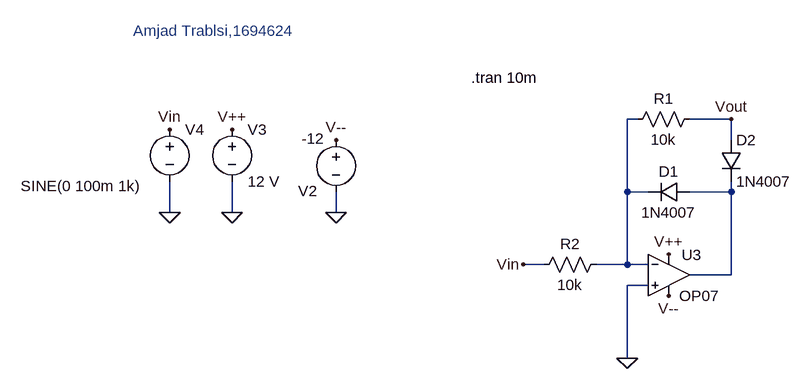
[diagram p0: schematic 1_1 Diode.asc]
1_1 Diode.asc, the LTspice schematic file:
Version 4
SHEET 1 880 680
WIRE 224 -64 208 -64
WIRE 368 -64 304 -64
WIRE 368 -32 368 -64
WIRE 208 48 208 -64
WIRE 240 48 208 48
WIRE 368 48 368 32
WIRE 368 48 304 48
WIRE -496 80 -496 32
WIRE -400 80 -400 32
WIRE -240 80 -240 48
WIRE 80 160 48 160
WIRE 208 160 208 48
WIRE 208 160 160 160
WIRE 240 160 208 160
WIRE 368 176 368 48
WIRE 368 176 304 176
WIRE 240 192 208 192
WIRE 208 304 208 192
FLAG 208 304 0
FLAG -400 80 0
FLAG -496 80 0
FLAG -400 -48 V++
FLAG 272 208 V--
FLAG 272 144 V++
FLAG -496 -48 Vin
FLAG 48 160 Vin
FLAG 368 -64 Vout
FLAG -240 80 0
FLAG -240 -32 V--
SYMBOL res 320 -80 R90
WINDOW 0 0 56 VBottom 2
WINDOW 3 32 56 VTop 2
SYMATTR InstName R1
SYMATTR Value 10k
SYMBOL diode 304 32 R90
WINDOW 0 0 32 VBottom 2
WINDOW 3 32 32 VTop 2
SYMATTR InstName D1
SYMATTR Value 1N4007
SYMBOL diode 352 -32 R0
SYMATTR InstName D2
SYMATTR Value 1N4007
SYMBOL res 176 144 R90
WINDOW 0 0 56 VBottom 2
WINDOW 3 32 56 VTop 2
SYMATTR InstName R2
SYMATTR Value 10k
SYMBOL voltage -240 -48 R0
WINDOW 0 -58 95 Left 2
WINDOW 3 -53 14 Left 2
WINDOW 123 0 0 Left 0
WINDOW 39 0 0 Left 0
SYMATTR InstName V2
SYMATTR Value -12
SYMBOL voltage -400 -64 R0
WINDOW 123 0 0 Left 0
WINDOW 39 0 0 Left 0
SYMATTR InstName V3
SYMATTR Value 12 V
SYMBOL voltage -496 -64 R0
WINDOW 3 -229 103 Left 2
WINDOW 123 0 0 Left 0
WINDOW 39 0 0 Left 0
SYMATTR InstName V4
SYMATTR Value SINE(0 100m 1k)
SYMBOL OpAmps\\OP07 272 112 R0
WINDOW 0 20 33 Left 2
SYMATTR InstName U3
TEXT -32 -128 Left 2 !.tran 10m
TEXT -552 -200 Left 2 ;Amjad Trablsi,1694624

The netlist it stands for:
* 1_1 Diode.asc
R1 Vout N001 10k
D1 N002 N001 1N4007
D2 Vout N002 1N4007
R2 N001 Vin 10k
V2 V-- 0 -12
V3 V++ 0 12 V
V4 Vin 0 SINE(0 100m 1k)
XU3 0 N001 V++ V-- N002 LT1001  ; OP07, pins In+ In- V+ V- OUT
.model D D
.lib standard.dio
.tran 10m
* Amjad Trablsi,1694624
.lib LTC.lib
.backanno
.end